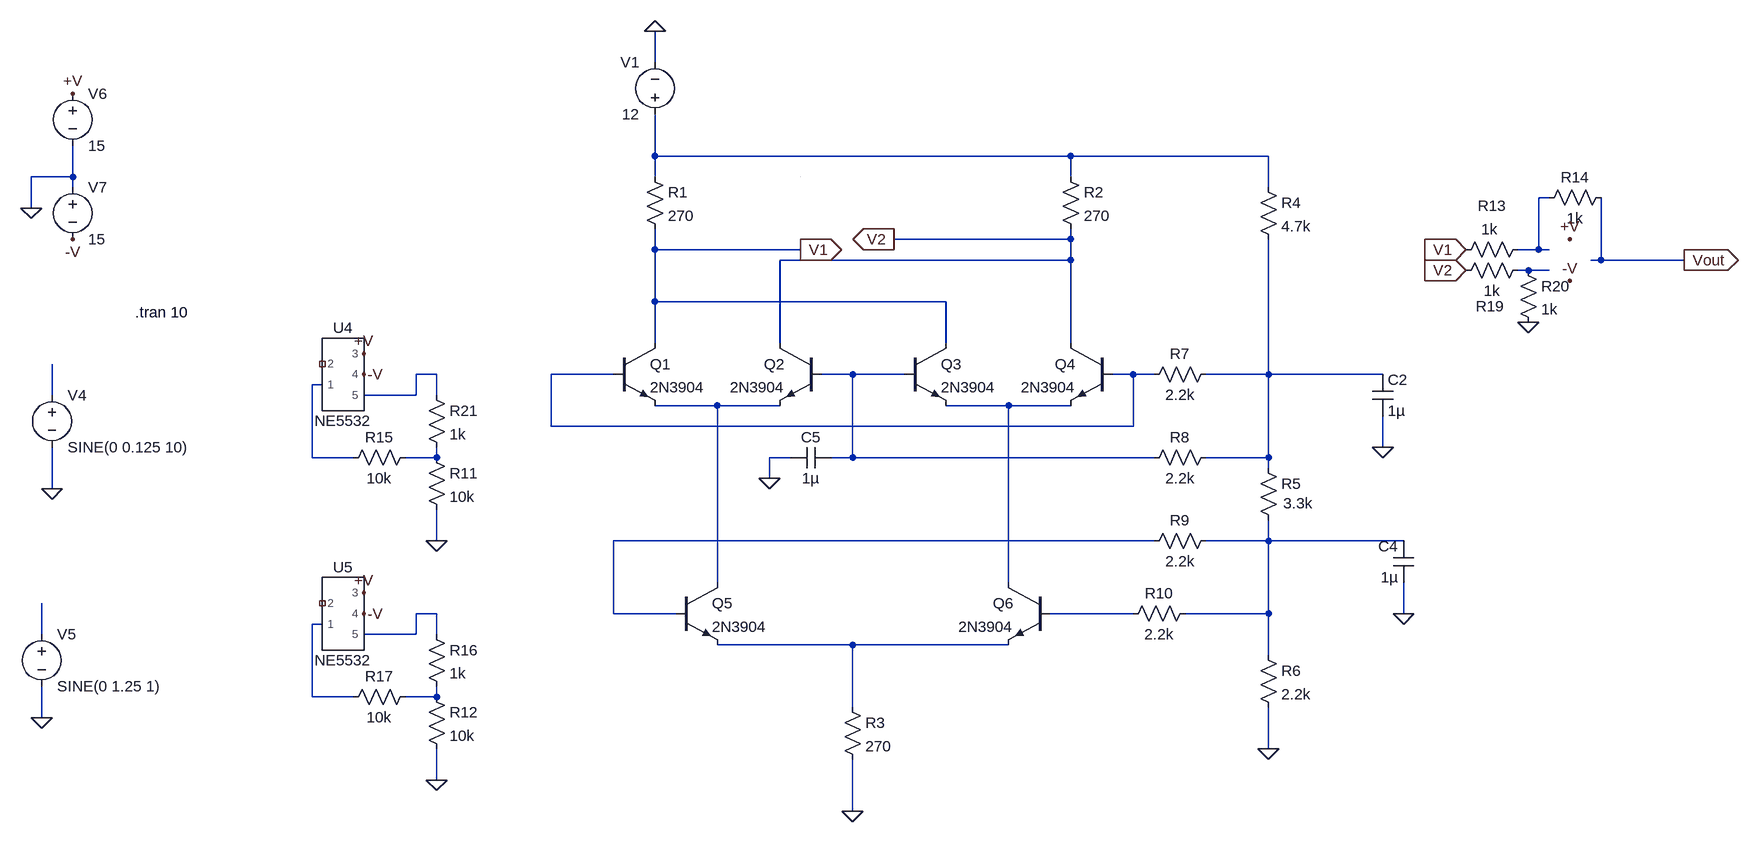
[diagram p0: schematic Multiplier_final_edited.asc]
Multiplier_final_edited.asc, the LTspice schematic file:
Version 4.1
SHEET 1 1472 1016
WIRE -224 -176 -224 -224
WIRE -224 -32 -224 -96
WIRE 416 -32 -224 -32
WIRE 720 -32 416 -32
WIRE -1120 0 -1120 -48
WIRE -1120 0 -1184 0
WIRE -224 0 -224 -32
WIRE 416 0 416 -32
WIRE -1120 16 -1120 0
WIRE 720 16 720 -32
WIRE 1152 32 1136 32
WIRE -1184 48 -1184 0
WIRE 416 96 416 80
WIRE 416 96 144 96
WIRE -224 112 -224 80
WIRE 0 112 -224 112
WIRE 1136 112 1136 32
WIRE 1136 112 1104 112
WIRE 1152 112 1136 112
WIRE 416 128 416 96
WIRE 416 128 -32 128
WIRE 1232 128 1232 32
WIRE 1232 128 1216 128
WIRE 1360 128 1232 128
WIRE 1120 144 1104 144
WIRE 1152 144 1120 144
WIRE -224 192 -224 112
WIRE 224 192 -224 192
WIRE -224 256 -224 192
WIRE -32 256 -32 128
WIRE 224 256 224 192
WIRE 416 256 416 128
WIRE -560 304 -592 304
WIRE -288 304 -384 304
WIRE 80 304 32 304
WIRE 160 304 80 304
WIRE 512 304 480 304
WIRE 544 304 512 304
WIRE 720 304 720 96
WIRE 720 304 624 304
WIRE 896 304 720 304
WIRE -736 320 -752 320
WIRE -1152 336 -1152 288
WIRE -592 336 -592 304
WIRE -592 336 -672 336
WIRE -560 336 -560 304
WIRE -128 352 -224 352
WIRE -32 352 -128 352
WIRE 320 352 224 352
WIRE 416 352 320 352
WIRE -384 384 -384 304
WIRE 512 384 512 304
WIRE 512 384 -384 384
WIRE 896 416 896 368
WIRE -752 432 -752 320
WIRE -688 432 -752 432
WIRE -560 432 -560 416
WIRE -560 432 -608 432
WIRE -16 432 -48 432
WIRE 80 432 80 304
WIRE 80 432 48 432
WIRE 544 432 80 432
WIRE 720 432 720 304
WIRE 720 432 624 432
WIRE 720 448 720 432
WIRE -48 464 -48 432
WIRE -1152 480 -1152 416
WIRE -560 560 -560 512
WIRE 544 560 -288 560
WIRE 720 560 720 528
WIRE 720 560 624 560
WIRE 928 560 720 560
WIRE -128 624 -128 352
WIRE 320 624 320 352
WIRE -560 672 -592 672
WIRE -288 672 -288 560
WIRE -192 672 -288 672
WIRE 512 672 384 672
WIRE 720 672 720 560
WIRE 720 672 592 672
WIRE 928 672 928 624
WIRE -736 688 -752 688
WIRE -1168 704 -1168 656
WIRE -592 704 -592 672
WIRE -592 704 -672 704
WIRE -560 704 -560 672
WIRE 80 720 -128 720
WIRE 320 720 80 720
WIRE 720 736 720 672
WIRE -752 800 -752 688
WIRE -688 800 -752 800
WIRE -560 800 -560 784
WIRE -560 800 -608 800
WIRE 80 816 80 720
WIRE -1168 832 -1168 784
WIRE 720 880 720 816
WIRE -560 928 -560 880
WIRE 80 976 80 896
WIRE 0 0 0 0
FLAG -224 -224 0
FLAG 720 880 0
FLAG 80 976 0
FLAG 896 416 0
FLAG 928 672 0
FLAG -48 464 0
FLAG -1152 480 0
FLAG -1168 832 0
FLAG -560 560 0
FLAG -1184 48 0
FLAG -1120 -128 +V
FLAG -1120 96 -V
FLAG 0 112 V1
IOPIN 0 112 Out
FLAG 144 96 V2
IOPIN 144 96 Out
FLAG 1184 96 +V
FLAG 1184 160 -V
FLAG 1024 112 V1
IOPIN 1024 112 In
FLAG 1024 144 V2
IOPIN 1024 144 In
FLAG 1120 224 0
FLAG 1360 128 Vout
IOPIN 1360 128 Out
FLAG -672 272 +V
FLAG -672 304 -V
FLAG -560 928 0
FLAG -672 640 +V
FLAG -672 672 -V
SYMBOL res -240 -16 R0
SYMATTR InstName R1
SYMATTR Value 270
SYMBOL res 400 -16 R0
SYMATTR InstName R2
SYMATTR Value 270
SYMBOL res 64 800 R0
SYMATTR InstName R3
SYMATTR Value 270
SYMBOL res 704 0 R0
SYMATTR InstName R4
SYMATTR Value 4.7k
SYMBOL res 704 432 R0
WINDOW 3 39 70 Left 2
SYMATTR Value 3.3k
SYMATTR InstName R5
SYMBOL res 704 720 R0
SYMATTR InstName R6
SYMATTR Value 2.2k
SYMBOL res 640 288 R90
WINDOW 0 0 56 VBottom 2
WINDOW 3 32 56 VTop 2
SYMATTR InstName R7
SYMATTR Value 2.2k
SYMBOL res 640 416 R90
WINDOW 0 0 56 VBottom 2
WINDOW 3 32 56 VTop 2
SYMATTR InstName R8
SYMATTR Value 2.2k
SYMBOL res 640 544 R90
WINDOW 0 0 56 VBottom 2
WINDOW 3 32 56 VTop 2
SYMATTR InstName R9
SYMATTR Value 2.2k
SYMBOL res 608 656 R90
WINDOW 0 0 56 VBottom 2
WINDOW 3 32 56 VTop 2
SYMATTR InstName R10
SYMATTR Value 2.2k
SYMBOL npn -288 256 R0
SYMATTR InstName Q1
SYMATTR Value 2N3904
SYMBOL npn 32 256 M0
SYMATTR InstName Q2
SYMATTR Value 2N3904
SYMBOL npn 160 256 R0
SYMATTR InstName Q3
SYMATTR Value 2N3904
SYMBOL npn 480 256 M0
SYMATTR InstName Q4
SYMATTR Value 2N3904
SYMBOL voltage -224 -80 R180
WINDOW 0 24 96 Left 2
WINDOW 3 24 16 Left 2
WINDOW 123 0 0 Left 0
WINDOW 39 0 0 Left 0
SYMATTR InstName V1
SYMATTR Value 12
SYMBOL voltage -1152 320 R0
WINDOW 123 0 0 Left 0
WINDOW 39 0 0 Left 0
SYMATTR InstName V4
SYMATTR Value SINE(0 0.125 10)
SYMBOL voltage -1168 688 R0
WINDOW 123 0 0 Left 0
WINDOW 39 0 0 Left 0
SYMATTR InstName V5
SYMATTR Value SINE(0 1.25 1)
SYMBOL npn -192 624 R0
SYMATTR InstName Q5
SYMATTR Value 2N3904
SYMBOL npn 384 624 M0
SYMATTR InstName Q6
SYMATTR Value 2N3904
SYMBOL cap 880 304 R0
SYMATTR InstName C2
SYMATTR Value 1µ
SYMBOL cap 944 624 R180
WINDOW 0 24 56 Left 2
WINDOW 3 24 8 Left 2
SYMATTR InstName C4
SYMATTR Value 1µ
SYMBOL cap 48 416 R90
WINDOW 0 0 32 VBottom 2
WINDOW 3 32 32 VTop 2
SYMATTR InstName C5
SYMATTR Value 1µ
SYMBOL res -576 416 R0
SYMATTR InstName R11
SYMATTR Value 10k
SYMBOL voltage -1120 -144 R0
WINDOW 123 0 0 Left 0
WINDOW 39 0 0 Left 0
SYMATTR InstName V6
SYMATTR Value 15
SYMBOL voltage -1120 0 R0
WINDOW 123 0 0 Left 0
WINDOW 39 0 0 Left 0
SYMATTR InstName V7
SYMATTR Value 15
SYMBOL res 1248 16 R90
WINDOW 0 0 56 VBottom 2
WINDOW 3 32 56 VTop 2
SYMATTR InstName R14
SYMATTR Value 1k
SYMBOL res 1120 96 R90
WINDOW 0 -36 56 VBottom 2
WINDOW 3 -31 60 VTop 2
SYMATTR InstName R13
SYMATTR Value 1k
SYMBOL res 1120 128 R90
WINDOW 0 87 59 VBottom 2
WINDOW 3 32 56 VTop 2
SYMATTR InstName R19
SYMATTR Value 1k
SYMBOL res 1104 128 R0
SYMATTR InstName R20
SYMATTR Value 1k
SYMBOL res -576 320 R0
SYMATTR InstName R21
SYMATTR Value 1k
SYMBOL NE5532 -704 304 R0
SYMATTR InstName U4
SYMBOL res -592 416 R90
WINDOW 0 0 56 VBottom 2
WINDOW 3 32 56 VTop 2
SYMATTR InstName R15
SYMATTR Value 10k
SYMBOL res -576 784 R0
SYMATTR InstName R12
SYMATTR Value 10k
SYMBOL res -576 688 R0
SYMATTR InstName R16
SYMATTR Value 1k
SYMBOL NE5532 -704 672 R0
SYMATTR InstName U5
SYMBOL res -592 784 R90
WINDOW 0 0 56 VBottom 2
WINDOW 3 32 56 VTop 2
SYMATTR InstName R17
SYMATTR Value 10k
TEXT -1024 208 Left 2 !.tran 10

The netlist it stands for:
* Multiplier_final_edited.asc
R1 N001 V1 270
R2 N001 V2 270
R3 N019 0 270
R4 N001 N007 4.7k
R5 N007 N014 3.3k
R6 N014 0 2.2k
R7 N007 N005 2.2k
R8 N007 N006 2.2k
R9 N014 N013 2.2k
R10 N014 N016 2.2k
Q1 V1 N005 N010 0 2N3904
Q2 V2 N006 N010 0 2N3904
Q3 V1 N006 N011 0 2N3904
Q4 V2 N005 N011 0 2N3904
V1 N001 0 12
V4 N009 0 SINE(0 0.125 10)
V5 N018 0 SINE(0 1.25 1)
Q5 N010 N013 N019 0 2N3904
Q6 N011 N016 N019 0 2N3904
C2 N007 0 1µ
C4 0 N014 1µ
C5 N006 0 1µ
R11 N012 0 10k
V6 +V 0 15
V7 0 -V 15
R14 Vout N002 1k
R13 N002 V1 1k
R19 N003 V2 1k
R20 N003 0 1k
R21 N004 N012 1k
X§U4 N008 NC_01 +V -V N004 NE5532  ; pins 1 2 3 4 5
R15 N012 N008 10k
R12 N020 0 10k
R16 N015 N020 1k
X§U5 N017 NC_02 +V -V N015 NE5532  ; pins 1 2 3 4 5
R17 N020 N017 10k
.model NPN NPN
.model PNP PNP
.lib standard.bjt
.tran 10
.lib NE5532.lib
.backanno
.end